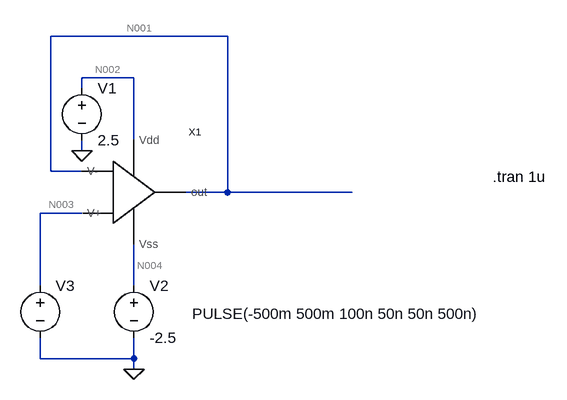
[diagram p0: schematic slew_rate.asc]
slew_rate.asc, the LTspice schematic file:
Version 4
SHEET 1 880 680
WIRE 288 -96 16 -96
WIRE 144 -32 64 -32
WIRE 64 -16 64 -32
WIRE 144 64 144 -32
WIRE 64 80 64 64
WIRE 16 112 16 -96
WIRE 64 112 16 112
WIRE 288 144 288 -96
WIRE 288 144 224 144
WIRE 480 144 288 144
WIRE 64 176 0 176
WIRE 0 288 0 176
WIRE 144 288 144 224
WIRE 0 400 0 368
WIRE 144 400 144 368
WIRE 144 400 0 400
WIRE 144 416 144 400
FLAG 64 80 0
FLAG 144 416 0
SYMBOL voltage 64 -32 R0
WINDOW 123 0 0 Left 0
WINDOW 39 0 0 Left 0
SYMATTR InstName V1
SYMATTR Value 2.5
SYMBOL voltage 144 272 R0
WINDOW 123 0 0 Left 0
WINDOW 39 0 0 Left 0
SYMATTR InstName V2
SYMATTR Value -2.5
SYMBOL voltage 0 272 R0
WINDOW 123 0 0 Left 0
WINDOW 39 0 0 Left 0
WINDOW 3 234 59 Left 2
SYMATTR Value PULSE(-500m 500m 100n 50n 50n 500n)
SYMATTR InstName V3
SYMBOL OPAMP 32 144 R0
SYMATTR InstName X1
TEXT 696 120 Left 2 !.tran 1u

The netlist it stands for:
* slew_rate.asc
V1 N002 0 2.5
V2 N004 0 -2.5
V3 N003 0 PULSE(-500m 500m 100n 50n 50n 500n)
XX1 N002 N004 N001 N003 N001 OPAMP  ; pins Vdd Vss V- V+ out
.tran 1u
.backanno
.end

* Results of the author's LTspice run, read from the files saved beside the schematic
* Operating Point, zero values left out:
*   V(n002) = 2.5 V
*   V(n004) = -2.5 V
*   V(n003) = -500 mV
*   V(n001) = -499.9 mV
*   I(V1) = -185.5 µA
*   I(V2) = 185.5 µA
*   Ix(x1:VDD) = 185.5 µA
*   Ix(x1:VSS) = -185.5 µA
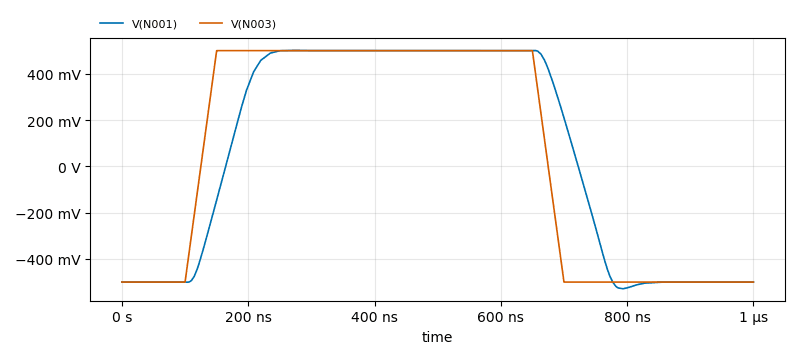
[diagram p1: Transient Analysis of slew_rate.asc, plotted from the saved traces]
* Transient Analysis, 1 run:
*   V(N001): min -529.1 mV, max 501.3 mV, average 55.35 mV, rms 463.9 mV, last -499.9 mV
*   V(N003): min -500 mV, max 500 mV, average 50 mV, rms 483.4 mV, last -500 mV